# Altium schematic sheet battery_diode-discharging.SchDoc: Battery Discharging - Ideal Diode
size A4; Date: 2015-09-22; Author: Piotr Kuligowski; DocumentNumber: 1; Revision: 1-0; SheetNumber: 1; SheetTotal: 14; Model: EM1
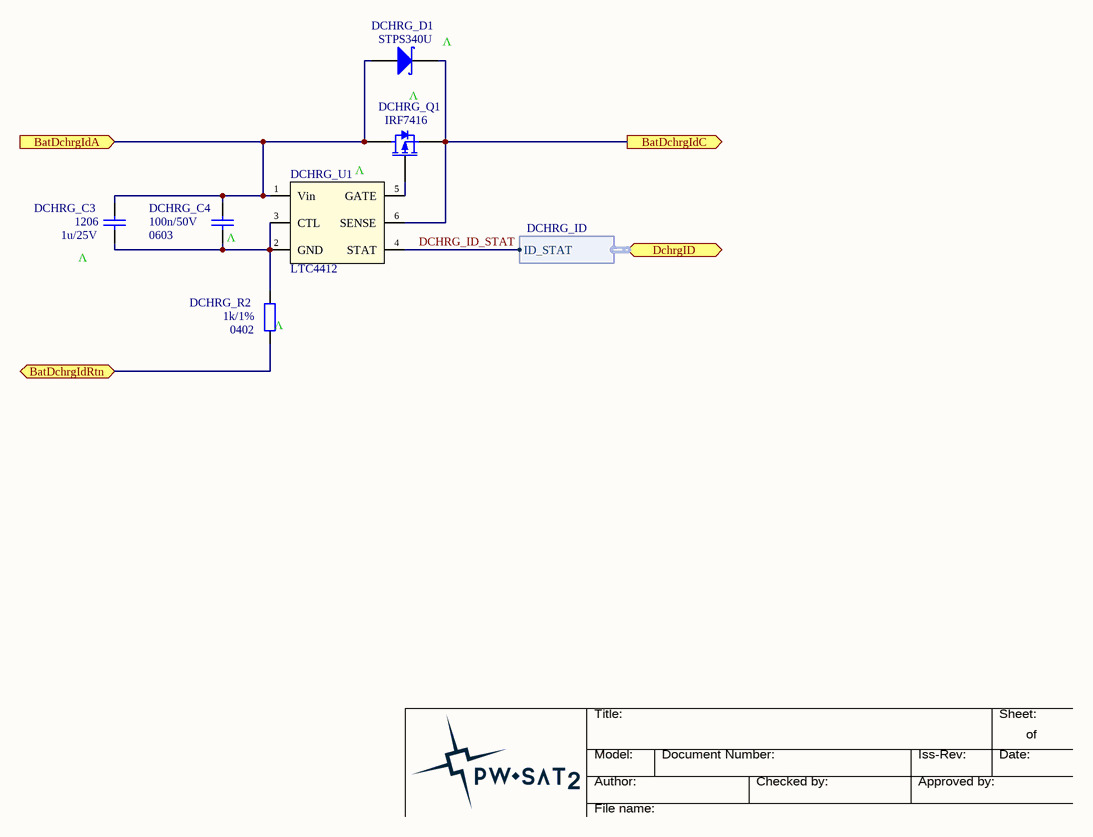
[diagram p0: battery_diode-discharging.SchDoc]

## Parts
DCHRG_C3  Package: 1206  [SMD_Capacitor_1206]  (hidden comment: 1u/25V)
DCHRG_C4  Package: 0603  [SMD_Capacitor_0603]  (hidden comment: 100n/50V)
DCHRG_D1  STPS340U  [DO-214AA]
DCHRG_Q1  IRF7416  [SOIC-8-N_SSSGDDDD]
DCHRG_R2  Package: 0402  [SMD_Resistor_0402]  (hidden comment: 1k/1%)
DCHRG_U1  LTC4412  [SOT23-6]

## Ports
BatDchrgIdA (in), BatDchrgIdC (out), BatDchrgIdRtn, DchrgID (harness DCHRG_ID)

## Harnesses
DCHRG_ID: ID_STAT

## Nets
BatDchrgIdA: DCHRG_C3.1 DCHRG_C4.1 DCHRG_D1.A DCHRG_Q1.D DCHRG_U1.1(Vin) ; port BatDchrgIdA
BatDchrgIdC: DCHRG_D1.K DCHRG_Q1.S DCHRG_U1.6(SENSE) ; port BatDchrgIdC
BatDchrgIdRtn: DCHRG_R2.2 ; port BatDchrgIdRtn
DCHRG_ID_STAT: DCHRG_U1.4(STAT) ; port DchrgID.ID_STAT
NetDCHRG_C3_2: DCHRG_C3.2 DCHRG_C4.2 DCHRG_R2.1 DCHRG_U1.2(GND) DCHRG_U1.3(CTL)
NetDCHRG_Q1_G: DCHRG_Q1.G DCHRG_U1.5(GATE)

## Notes on the sheet
- (near DCHRG_D1) V
- V
- (near DCHRG_C3) V
- (near DCHRG_C4) V
- (near DCHRG_R2) V
- Title:
- Sheet:
- of
- Author:
- Model:
- Document Number:
- Checked by:
- Iss-Rev:
- Approved by:
- Date:
- File name:

## Library data of the parts
DCHRG_C3 = Cer_C1206T105K3RALTU: Ceramic Cap Kemet COTS 1u/25V X7R 1206; ManufacturerPartNumber: C1206T105K3RALTU; Manufacturer: Kemet; Value: 1u/25V
DCHRG_C4 = Cer_GCJ188R71H104KA12D: Ceramic Cap Murata Automotive 100n/50V X7R 0603; Manufacturer: Murata; ManufacturerPartNumber: GCJ188R71H104KA12D; Value: 100n/50V
DCHRG_D1 = STPS340x: 3A/40V Power Schottky Rectifier.; Manufacturer: STMicroelectronics; Value: STPS340U
DCHRG_Q1 = IRF7416: 10A/30V HEXFET Power P-MOSFET.; Manufacturer: International Rectifier; Value: IRF7416
DCHRG_R2 = CRCW04021K00FKxxxx: 1k/1% Vishay CRCW 0402 Resistor. 63mW, 100ppm, 50V.; Manufacturer: Vishay; ManufacturerPartNumber: CRCW04021K00FKxxxx; Value: 1k/1%
DCHRG_U1 = LTC4412: Ideal Diode, Low Loss PowerPath Controller.; Manufacturer: Linear Technology; Value: LTC4412